# EAGLE design PCB Design (EAGLE 8.6.3)

## Sheet 1 of 2
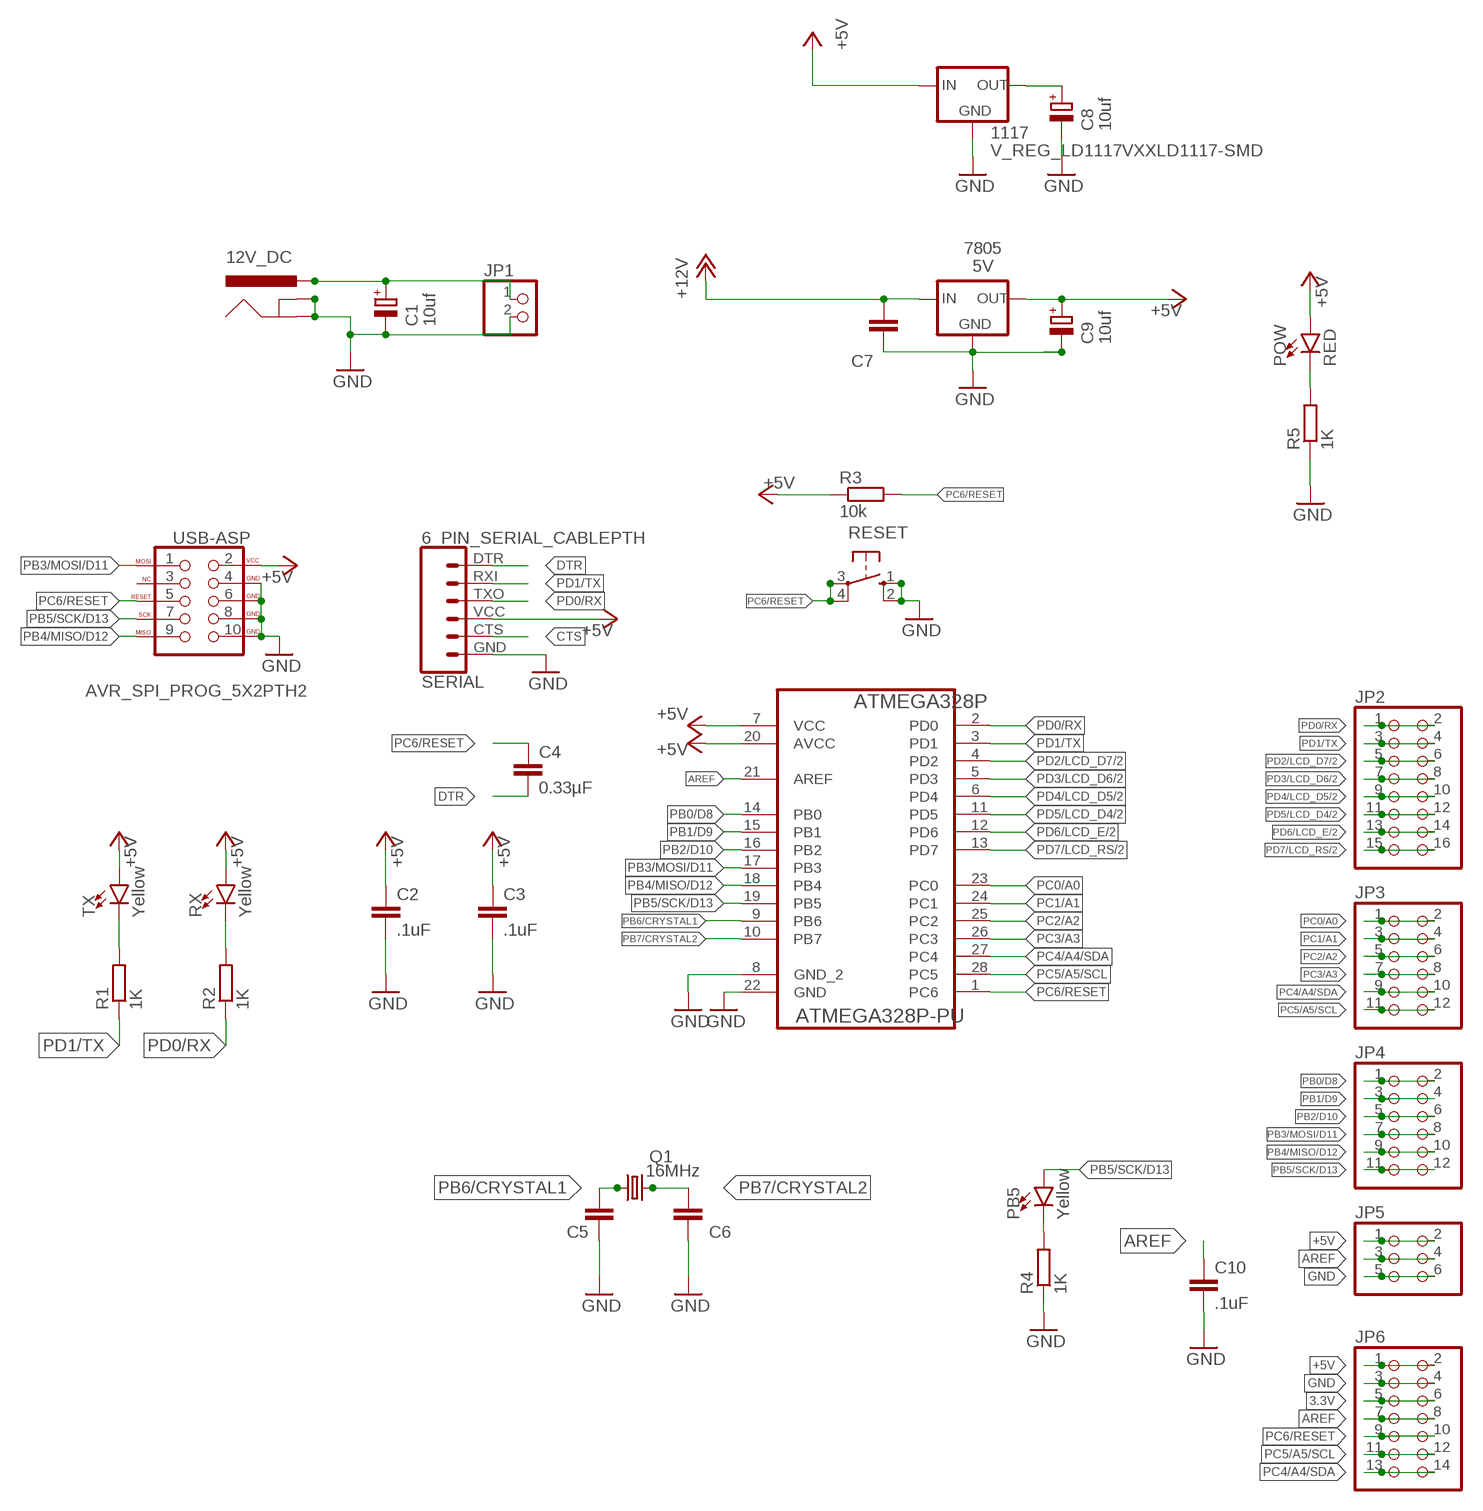
[diagram p0: schematic, sheet 1]

### Parts
12V_DC  POWER_JACK  [POWER_JACK_PTH]
1117  V_REG_LD1117VXXLD1117-SMD  [SOT223]
7805  5V  V_REG_78XX7812  [TO-252]
ATMEGA328P  ATMEGA328P-PU  [DIP254P762X457-28]
C1  10uf  CPOL-EUE2.5-6  [E2,5-6]
C2  .1uF  C-EUC0805K  [C0805K]
C3  .1uF  C-EUC0805K  [C0805K]
C4  0.33µF  C-EUC0805K  [C0805K]
C5  22pF  C-EUC0805K  [C0805K]
C6  22pF  C-EUC0805K  [C0805K]
C7  .1uf  C-EUC0805K  [C0805K]
C8  10uf  CPOL-EUE2.5-6  [E2,5-6]
C9  10uf  CPOL-EUE2.5-6  [E2,5-6]
C10  .1uF  C-EUC0805K  [C0805K]
JP1  PINHD-1X2  [1X02]
JP2  PINHD-2X8  [2X08]
JP3  PINHD-2X6  [2X06]
JP4  PINHD-2X6  [2X06]
JP5  PINHD-2X3  [2X03]
JP6  PINHD-2X7  [2X07]
PB5  Yellow  LED-BLUE0603  [LED-0603]
POW  RED  LED-BLUE0603  [LED-0603]
Q1  16MHz  CRYSTALHC49U70  [HC49U70]
R1  1K  R-EU_M0805  [M0805]
R2  1K  R-EU_M0805  [M0805]
R3  10k  R-EU_M0805  [M0805]
R4  1K  R-EU_M0805  [M0805]
R5  1K  R-EU_M0805  [M0805]
RESET  10-XX  [B3F-10XX]
RX  Yellow  LED-BLUE0603  [LED-0603]
SERIAL  6_PIN_SERIAL_CABLEPTH  [FTDI_BASIC]
TX  Yellow  LED-BLUE0603  [LED-0603]
USB-ASP  AVR_SPI_PROG_5X2PTH2  [2X5-SHROUDED]

### Nets
3.3V: 1117.2(OUT) C8.+ JP6.5 JP6.6
+5V: 1117.3(IN) 7805.2(OUT) ATMEGA328P.7(VCC) ATMEGA328P.20(AVCC) C2.1 C3.1 C9.+ JP5.1 JP5.2 JP6.1 JP6.2 POW.A R3.1 RX.A SERIAL.VCC TX.A USB-ASP.2(VCC) ; also sheet 2
+12V: 12V_DC.PWR 7805.1(IN) C1.+ C7.1 JP1.1
AREF: ATMEGA328P.21(AREF) C10.1 JP5.3 JP5.4 JP6.7 JP6.8
CTS: SERIAL.CTS
DTR: C4.2 SERIAL.DTR
GND: 12V_DC.GND 12V_DC.GNDBREAK 1117.1(GND) 7805.3(GND) ATMEGA328P.8(GND_2) ATMEGA328P.22(GND) C1.- C2.2 C3.2 C5.1 C6.1 C7.2 C8.- C9.- C10.2 JP1.2 JP5.5 JP5.6 JP6.3 JP6.4 R4.1 R5.1 RESET.1(S) RESET.2(S1) SERIAL.GND USB-ASP.4(GND) USB-ASP.6(GND) USB-ASP.8(GND) USB-ASP.10(GND) ; also sheet 2
N$1: PB5.C R4.2
N$2: POW.C R5.2
N$8: R2.2 RX.C
N$9: R1.2 TX.C
PB0/D8: ATMEGA328P.14(PB0) JP4.1 JP4.2
PB1/D9: ATMEGA328P.15(PB1) JP4.3 JP4.4
PB2/D10: ATMEGA328P.16(PB2) JP4.5 JP4.6
PB3/MOSI/D11: ATMEGA328P.17(PB3) JP4.7 JP4.8 USB-ASP.1(MOSI)
PB4/MISO/D12: ATMEGA328P.18(PB4) JP4.9 JP4.10 USB-ASP.9(MISO)
PB5/SCK/D13: ATMEGA328P.19(PB5) JP4.11 JP4.12 PB5.A USB-ASP.7(SCK)
PB6/CRYSTAL1: ATMEGA328P.9(PB6) C5.2 Q1.1
PB7/CRYSTAL2: ATMEGA328P.10(PB7) C6.2 Q1.2
PC0/A0: ATMEGA328P.23(PC0) JP3.1 JP3.2
PC1/A1: ATMEGA328P.24(PC1) JP3.3 JP3.4
PC2/A2: ATMEGA328P.25(PC2) JP3.5 JP3.6
PC3/A3: ATMEGA328P.26(PC3) JP3.7 JP3.8
PC4/A4/SDA: ATMEGA328P.27(PC4) JP3.9 JP3.10 JP6.13 JP6.14
PC5/A5/SCL: ATMEGA328P.28(PC5) JP3.11 JP3.12 JP6.11 JP6.12
PC6/RESET: ATMEGA328P.1(PC6) C4.1 JP6.9 JP6.10 R3.2 RESET.3(P) RESET.4(P1) USB-ASP.5(RESET)
PD0/RX: ATMEGA328P.2(PD0) JP2.1 JP2.2 R2.1 SERIAL.TXO
PD1/TX: ATMEGA328P.3(PD1) JP2.3 JP2.4 R1.1 SERIAL.RXI
PD2/LCD_D7: ATMEGA328P.4(PD2) JP2.5 JP2.6 ; also sheet 2
PD3/LCD_D6: ATMEGA328P.5(PD3) JP2.7 JP2.8 ; also sheet 2
PD4/LCD_D5: ATMEGA328P.6(PD4) JP2.9 JP2.10 ; also sheet 2
PD5/LCD_D4: ATMEGA328P.11(PD5) JP2.11 JP2.12 ; also sheet 2
PD6/LCD_E: ATMEGA328P.12(PD6) JP2.13 JP2.14 ; also sheet 2
PD7/LCD_RS: ATMEGA328P.13(PD7) JP2.15 JP2.16 ; also sheet 2
Unconnected: USB-ASP.3(NC)

## Sheet 2 of 2
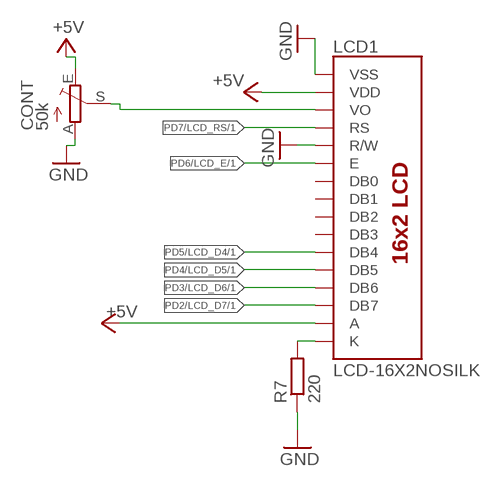
[diagram p1: schematic, sheet 2]

### Parts
CONT  50k  TRIM_EU-S64W  [S64W]
LCD1  LCD-16X2NOSILK  [LCD-16X2_NOSILK]
R7  220  R-EU_M0805  [M0805]

### Nets
+5V: CONT.E LCD1.2(VDD) LCD1.15(A) ; also sheet 1
GND: CONT.A LCD1.1(VSS) LCD1.5(R/W) R7.1 ; also sheet 1
N$6: CONT.S LCD1.3(VO)
N$14: LCD1.16(K) R7.2
PD2/LCD_D7: LCD1.14(DB7) ; also sheet 1
PD3/LCD_D6: LCD1.13(DB6) ; also sheet 1
PD4/LCD_D5: LCD1.12(DB5) ; also sheet 1
PD5/LCD_D4: LCD1.11(DB4) ; also sheet 1
PD6/LCD_E: LCD1.6(E) ; also sheet 1
PD7/LCD_RS: LCD1.4(RS) ; also sheet 1
Unconnected: LCD1.7(DB0) LCD1.8(DB1) LCD1.9(DB2) LCD1.10(DB3)

## Library data of the parts
12V_DC = SparkFun-Connectors:POWER_JACK: Power Jack Connector This is the standard 5.5mm barrel jack for power. The PTH is the most common, proven, reliable, footprint. The Slot footprint only works if the mill layer is transmitted to the PCB fab house so be warned. Here are the connectors we sell at SparkFun: DC Barrel Power Jack/Connector <https://www.sparkfun.com/products/119> (PRT-00119) DC Barrel Power Jack/Connector (SMD) <https://www.sparkfun.com/products/12748> (PRT-12748) DC Barrel Jack Adapter - Breadboard Compatible <https://www.sparkfun.com/products/10811> (PRT-10811) It is used on this SparkFun product (and many, many others): SparkFun RedBoard - Programmed with Arduino <https://www.sparkfun.com/products/12757> (DEV-12757) Also, if you need a mating power supply or connector, please check these out: Wall Adapter Power Supply - 9VDC 650mA <https://www.sparkfun.com/products/298> (TOL-00298) DC Barrel Jack Adapter - Male <https://www.sparkfun.com/products/10287> (PRT-10287); MF: MULTICOMP; MPN: SPC21365; OC_FARNELL: 1310918; PROD_ID: CONN-08197
1117 = SparkFun-IC-Power:V_REG_LD1117VXX: LD1117VXX voltage regulator. We carry the 3.3V version (COM-00526) in TO-220 package.; OC_FARNELL: unknown; PROD_ID: VREG-13917
7805 = SparkFun-IC-Power:V_REG_78XX: Voltage Regulator Standard 78xx regulator. IGO (Input Ground Output). Spark Fun Electronics SKU : COM-00107; OC_FARNELL: unknown; PROD_ID: VREG-12370; VALUE: +12v
ATMEGA328P = Atmel_By_element14_Batch_1-00:ATMEGA328P-PU: 8-bit Microcontroller with In-System Programmable Flash; MF: MICROCHIP; MPN: ATMEGA328P-PU; OC_FARNELL: 1715487; OC_NEWARK: 15R0268; PACKAGE: PDIP-28; SUPPLIER: Atmel
C1 C8 C9 = resistor:CPOL-EU: POLARIZED CAPACITOR, European symbol; OC_FARNELL: unknown
C2-C7 C10 = rcl:C-EU: CAPACITOR, European symbol; OC_FARNELL: unknown
CONT = pot:TRIM_EU-: POTENTIOMETER; OC_FARNELL: unknown
JP1 = pinhead:PINHD-1X2: PIN HEADER; OC_FARNELL: unknown
JP2 = pinhead:PINHD-2X8: PIN HEADER; OC_FARNELL: unknown
JP3 JP4 = pinhead:PINHD-2X6: PIN HEADER; OC_FARNELL: unknown
JP5 = pinhead:PINHD-2X3: PIN HEADER; OC_FARNELL: unknown
JP6 = pinhead:PINHD-2X7: PIN HEADER; OC_FARNELL: unknown
LCD1 = SparkFun-Displays:LCD-16X2: Standard text-only 16x2 parallel input LCD Basic 16 character by 2 line display. Typically utilizes the extremely common HD44780 parallel interface chipset SparkFun Products: Basic 16x2 Green <https://www.sparkfun.com/products/255> Basic 8x2 Green <https://www.sparkfun.com/products/11122>; OC_FARNELL: unknown; SF_ID: LCD-00255
PB5 POW RX TX = SparkFun-LED:LED-BLUE: Blue SMD LED Used in manufacturing of various products at SparkFun Packages: 0603 - SMD 0603 package [Product Link] <http://www.digikey.com/product-detail/en/SMLE12BC7TT86/511-1589-2-ND/1641808> 1206 - SMD1206 package [Product Link] <http://www.digikey.com/product-detail/en/lite-on-inc/LTST-C150TBKT/160-1643-1-ND/573584> SparkFun Products: ESP8266 Thing-Dev Board <https://www.sparkfun.com/products/13711> RedBoard <https://www.sparkfun.com/products/12757>; OC_FARNELL: unknown; PROD_ID: DIO-08575; VALUE: BLUE
Q1 = crystal:CRYSTAL: CRYSTAL; OC_FARNELL: unknown; OC_NEWARK: unknown
R1-R5 R7 = resistor:R-EU_: RESISTOR, European symbol; OC_FARNELL: unknown
RESET = switch-omron:10-XX: OMRON SWITCH; MF: OMRON ELECTRONIC COMPONENTS; MPN: B3F-1000; OC_FARNELL: 176432; OC_NEWARK: 36M3542
SERIAL = SparkFun-Connectors:6_PIN_SERIAL_CABLE: 6-pin header connection for use with the "FTDI BASIC" pinout - CABLE SIDE. Also known as "Arduino Serial Program Header". This is used on a design to provide a 6-pin connection point for serial communication usually from a USB cable (D+/D-) to these headers (RX/TX). It also has the remaining pins necessary for programming in the Arduino evironment (DTR, GND, and sometimes VCC). Note, this device has "CABLE" in the name. It is intended to be used on a design that usually lives on the end of your USB cable and prvides the converter chip (FTDI232 or FTDI231x) to commnicate serial RX/TX. The "sister" device, named "TARGET" is inteneded to be used on a design that contains a target micro-controller that you wish to program. You can populate with some of these: Female Headers <https://www.sparkfun.com/products/115> (PRT-00115) For reference (or to suit your programming needs) check out these designs: SparkFun FTDI Basic Breakout - 5V <https://www.sparkfun.com/products/9716> (DEV-09716) SparkFun FTDI Basic Breakout - 3.3V <https://www.sparkfun.com/products/9873> (DEV-09873) SparkFun FTDI SmartBasic <https://www.sparkfun.com/products/12935> (DEV-12935) SparkFun Beefy 3 - FTDI Basic Breakout <https://www.sparkfun.com/products/13746> (DEV-13746); OC_FARNELL: unknown
USB-ASP = SparkFun-Connectors:AVR_SPI_PROG_5X2: AVR 10-pin ICSP Header This is the standard AVR In Circuit Serial Programming header. Minimal, but includes pin one indicator. Works with standard Olimex programmers. SparkFun Products: 2x5 AVR ICSP Male Header <https://www.sparkfun.com/products/778> - PTH 2x5 Pin Shrouded Header <https://www.sparkfun.com/products/8506> - PTH2; OC_FARNELL: unknown; PROD_ID: CONN-08671; SF_ID: PRT-08506

## Board
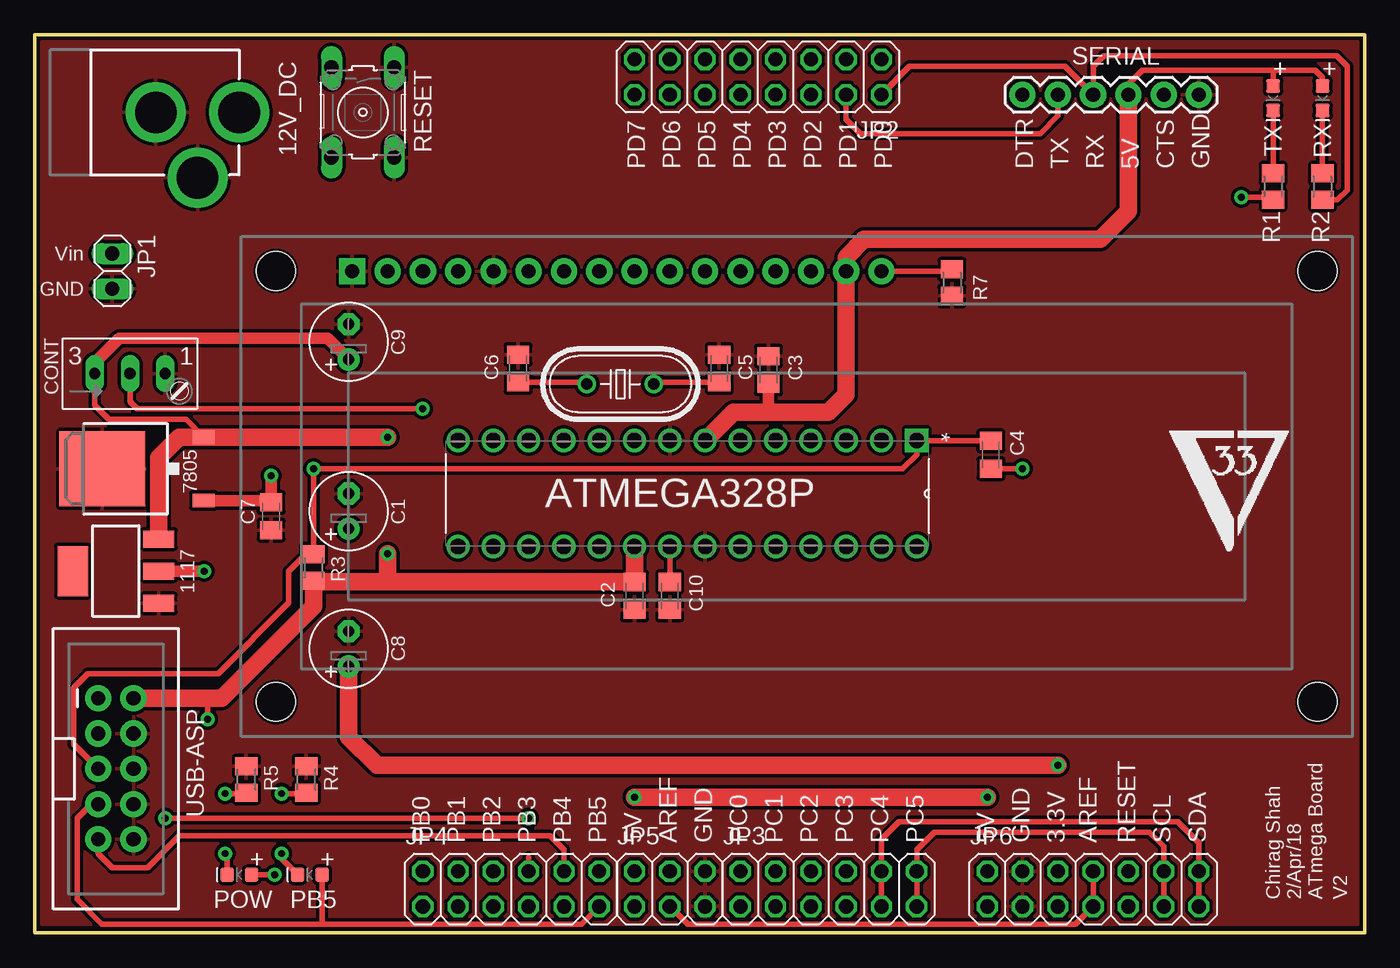
[diagram p2: board, top side]
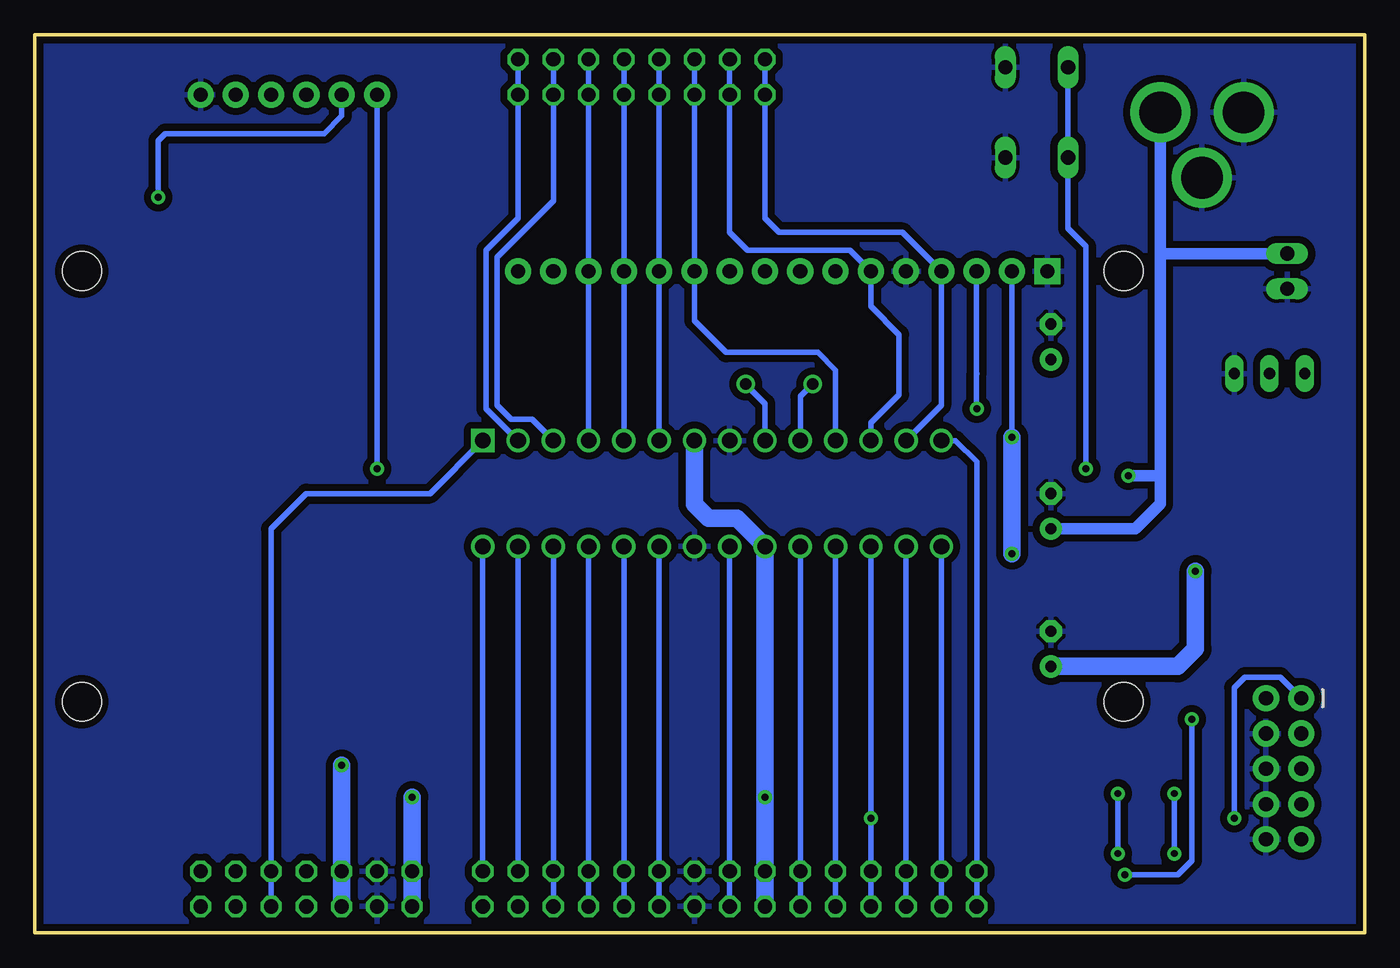
[diagram p3: board, bottom side, seen from below]

Size 95.76 x 64.64 mm. Coordinates in mm from the lower left corner, seen from the top.
Outline: 0,64.64 95.76,64.64 95.76,0 0,0 0,64.64
Copper layers (1*16): Top 0.035mm / dielectric 1.5mm / Bottom 0.035mm
Design rules "SparkFun-2-layer-STANDARD *": minimum track width 10mil, minimum drill 19mil, track to track 10mil, track to pad 8mil, pad to pad 8mil, via to via 10mil, smd to smd 8mil, copper to edge 8mil, drill to drill 8mil, minimum pad ring 10mil, minimum via ring 10mil, stop-mask expansion 4mil, vias tented up to drill 25mil, thermal gap 10mil

### Footprints (pad centres in the part's own frame; a part is rotated, then mirrored left to right if it is on the bottom)
POWER_JACK_PTH = drill 2.997 pad 4.318: GND 0,7.7; GNDBREAK 4.7,10.7; PWR 0,13.7
SOT223 = smd 1.219 x 2.235: 1 -2.311,-3.099; 2 0,-3.099; 3 2.311,-3.099 | smd 3.6 x 2.2: 4 0,3.099
TO-252 = smd 1 x 1.6: 1 -2.28,-4.8; 2 2.28,-4.8 | smd 5.4 x 6.2: 3 0,2.5
DIP254P762X457-28 = drill 1.118 square: 1 -7.62,33.02 | drill 1.118: 2 -7.62,30.48; 3 -7.62,27.94; 4 -7.62,25.4; 5 -7.62,22.86; 6 -7.62,20.32; 7 -7.62,17.78; 8 -7.62,15.24; 9 -7.62,12.7; 10 -7.62,10.16; 11 -7.62,7.62; 12 -7.62,5.08; 13 -7.62,2.54; 14 -7.62,0; 15 0,0; 16 0,2.54; 17 0,5.08; 18 0,7.62; 19 0,10.16; 20 0,12.7; 21 0,15.24; 22 0,17.78; 23 0,20.32; 24 0,22.86; 25 0,25.4; 26 0,27.94; 27 0,30.48; 28 0,33.02
E2,5-6 = drill 0.813 pad 1.6: + -1.27,0 | drill 0.813 pad 1.6 octagon: - 1.27,0
C0805K = smd 1.3 x 1.6: 1 -1,0; 2 1,0
S64W = drill 0.813 long: A 2.54,1.27; E -2.54,1.27; S 0,1.27
1X02 = drill 1.016 long: 1 -1.27,0; 2 1.27,0
2X08 = drill 1.016 octagon: 1 -8.89,-1.27; 2 -8.89,1.27; 3 -6.35,-1.27; 4 -6.35,1.27; 5 -3.81,-1.27; 6 -3.81,1.27; 7 -1.27,-1.27; 8 -1.27,1.27; 9 1.27,-1.27; 10 1.27,1.27; 11 3.81,-1.27; 12 3.81,1.27; 13 6.35,-1.27; 14 6.35,1.27; 15 8.89,-1.27; 16 8.89,1.27
2X06 = drill 1.016 octagon: 1 -6.35,-1.27; 2 -6.35,1.27; 3 -3.81,-1.27; 4 -3.81,1.27; 5 -1.27,-1.27; 6 -1.27,1.27; 7 1.27,-1.27; 8 1.27,1.27; 9 3.81,-1.27; 10 3.81,1.27; 11 6.35,-1.27; 12 6.35,1.27
2X03 = drill 1.016 octagon: 1 -2.54,-1.27; 2 -2.54,1.27; 3 0,-1.27; 4 0,1.27; 5 2.54,-1.27; 6 2.54,1.27
2X07 = drill 1.016 octagon: 1 -7.62,-1.27; 2 -7.62,1.27; 3 -5.08,-1.27; 4 -5.08,1.27; 5 -2.54,-1.27; 6 -2.54,1.27; 7 0,-1.27; 8 0,1.27; 9 2.54,-1.27; 10 2.54,1.27; 11 5.08,-1.27; 12 5.08,1.27; 13 7.62,-1.27; 14 7.62,1.27
LCD-16X2_NOSILK = drill 1.016 pad 1.88 square: 1 -32,15.5 | drill 1.016 pad 1.88: 2 -29.46,15.5; 3 -26.92,15.5; 4 -24.38,15.5; 5 -21.84,15.5; 6 -19.3,15.5; 7 -16.76,15.5; 8 -14.22,15.5; 9 -11.68,15.5; 10 -9.14,15.5; 11 -6.6,15.5; 12 -4.06,15.5; 13 -1.52,15.5; 14 1.02,15.5; 15 3.56,15.5; 16 6.1,15.5 | hole 2.8: -37.5,15.5; -37.5,-15.5; 37.5,15.5; 37.5,-15.5
LED-0603 = smd 1 x 1: A -0.877,0; C 0.877,0
HC49U70 = drill 0.813: 1 -2.413,0; 2 2.413,0
M0805 = smd 1.3 x 1.6: 1 -0.95,0; 2 0.95,0
B3F-10XX = drill 1.016 long: 1 -3.251,2.261; 2 3.251,2.261; 3 -3.251,-2.261; 4 3.251,-2.261
FTDI_BASIC = drill 1.016 pad 1.88: CTS 10.16,0; DTR 0,0; GND 12.7,0; RXI 2.54,0; TXO 5.08,0; VCC 7.62,0
2X5-SHROUDED = drill 1.016 pad 1.88: 1 -1.27,5.08; 2 1.27,5.08; 3 -1.27,2.54; 4 1.27,2.54; 5 -1.27,0; 6 1.27,0; 7 -1.27,-2.54; 8 1.27,-2.54; 9 -1.27,-5.08; 10 1.27,-5.08

### Placement (x,y rotation side)
12V_DC  1.02,59.05 270 top
1117  5.84,26.04 90 top
7805  7.37,33.4 90 top
ATMEGA328P  30.48,27.81 270 top
C1  22.61,30.35 90 top
C2  43.18,24.26 270 top
C3  52.83,40.51 90 top
C4  68.83,34.42 270 top
C5  49.28,40.62 270 top
C6  34.8,40.62 270 top
C7  17.02,29.99 270 top
C8  22.61,20.45 90 top
C9  22.61,42.55 90 top
C10  45.72,24.26 270 top
CONT  6.86,38.99 0 top
JP1  5.59,47.62 270 top
JP2  52.07,61.59 180 top
JP3  57.15,3.18 0 top
JP4  34.29,3.18 0 top
JP5  45.72,3.18 0 top
JP6  76.2,3.18 0 top
LCD1  54.86,32.13 0 top
PB5  19.81,4.19 180 top
POW  14.73,4.19 180 top
Q1  42.16,39.5 180 top
R1  89.15,53.72 90 top
R2  92.71,53.72 90 top
R3  20.07,26.29 90 top
R4  19.56,11.05 270 top
R5  15.24,11.05 270 top
R7  66.04,46.8 90 top
RESET  23.62,59.05 270 top
RX  92.71,60.07 270 top
SERIAL  71.12,60.33 0 top
TX  89.15,60.07 270 top
USB-ASP  5.84,11.81 0 top

### Tracks (layer width: path | path; a pad name or v marks a point on that pad's centre or on a via)
3.3V  (via drill 0.5)
  Top 0.813: v12.19,26.04 1117.2
  Top 1.27: C8.+ 22.61,14.1 24.64,12.07 v73.66,12.07
  Bottom 1.27: v12.19,26.04 12.19,20.45 13.46,19.18 C8.+ | JP6.5 JP6.6 v73.66,12.07
+5V  (via drill 0.5, 0.5 pad 0.55)
  Top 0.406: CONT.E 4.32,37.97 5.33,36.96 10.89,36.96 7805.2 12.19,35.71 | 12.45,16.89 v12.45,15.37 | v17.27,4.19 POW.A | SERIAL.VCC 78.74,61.09 79.76,62.1 89.15,62.1 | TX.A 89.15,62.1 | 89.15,62.1 92.2,62.1 92.71,61.59 RX.A
  Top 0.813: LCD1.15 | CONT.E 4.32,41.02 6.1,42.8 21.08,42.8 C9.+ | 20.15,25.26 R3.1 | v25.39,35.68 v25.4,35.69 | C3.1 52.83,37.47
  Top 1.27: ATMEGA328P.20 C2.1 25.4,25.26 | ATMEGA328P.7 50.29,37.47 52.83,37.47 57.15,37.47 58.42,38.73 LCD1.15 | SERIAL.VCC 78.74,51.94 76.71,49.91 59.69,49.91 58.42,48.64 LCD1.15 | 1117.3 8.94,34.21 10.41,35.68 7805.2 v25.39,35.68 | USB-ASP.2 12.45,16.89 13.46,16.89 20.07,23.5 R3.1 | v25.4,27.31 25.4,25.26 | 25.4,25.26 20.15,25.26 | v43.18,9.78 v68.58,9.78
  Bottom 0.406: v12.45,15.37 12.45,5.21 13.46,4.19 v17.27,4.19 | LCD1.2 v25.4,35.69
  Bottom 1.27: ATMEGA328P.7 48.26,30.86 47.24,29.85 45.21,29.85 ATMEGA328P.20 v43.18,9.78 JP5.2 JP5.1 | v68.58,9.78 JP6.2 JP6.1 | v25.4,35.69 v25.4,27.31
+12V  (via drill 0.5)
  Top 0.813: 7805.1 16.89,31.12 C7.1 v17.02,32.89
  Bottom 0.813: JP1.1 14.72,48.89 | 14.72,48.89 12V_DC.PWR | 14.72,48.89 14.72,32.89 | 14.72,32.89 14.72,30.88 16.51,29.08 C1.+ | v17.02,32.89 14.72,32.89
AREF
  Top 0.406: C10.1 ATMEGA328P.21 | JP5.3 47.02,0.61 74.91,0.61 JP6.7 JP6.8
  Bottom 0.406: JP5.3 JP5.4 ATMEGA328P.21
DTR  (via drill 0.5)
  Top 0.406: C4.2 68.85,33.4 v71.12,33.4
  Bottom 0.406: SERIAL.DTR v71.12,33.4
GND
  Top 0.406: 49.28,41.78 C5.1
  pour Bottom (isolate 0.508): 0.51,64.13 95.25,64.13 95.25,0.63 0.51,0.63
  pour Top: 95.25,0.63 95.25,64.13 0.51,64.13 0.51,0.63
N$1  (via drill 0.5)
  Top 0.406: v17.78,5.71 17.78,5.35 PB5.C | v17.78,10.03 19.49,10.03 R4.2
  Bottom 0.406: v17.78,10.03 v17.78,5.71
N$2  (via drill 0.5)
  Top 0.406: POW.C 13.86,5.58 v13.72,5.71 | v13.72,10.03 15.17,10.03 R5.2
  Bottom 0.406: v13.72,10.03 v13.72,5.71
N$6  (via drill 0.5)
  Top 0.406: CONT.S 6.86,38.23 7.37,37.72 v27.94,37.72
  Bottom 0.406: LCD1.3 27.94,40.26 | 27.94,40.26 | v27.94,37.72 27.94,40.26
N$8
  Top 0.406: RX.C R2.2
N$9
  Top 0.406: TX.C R1.2
N$14
  Top 0.406: 66.04,47.62 66.03,47.63 66.04,47.64 R7.2 65.92,47.63 LCD1.16
PB0/D8
  Bottom 0.406: ATMEGA328P.14 29.46,35.43 27.94,33.91 JP4.2 JP4.1
PB1/D9
  Bottom 0.406: ATMEGA328P.15 JP4.4 JP4.3
PB2/D10
  Bottom 0.406: ATMEGA328P.16 JP4.6 JP4.5
PB3/MOSI/D11  (via drill 0.5)
  Top 0.406: JP4.8 35.56,5.46 | v9.4,8.26 v35.56,8.26
  Bottom 0.406: ATMEGA328P.17 v35.56,8.26 JP4.8 JP4.7 | USB-ASP.1 6.1,18.41 8.64,18.41 9.4,17.65 v9.4,8.26
PB4/MISO/D12
  Top 0.406: JP4.10 38.1,5.97 37.08,6.98 10.41,6.98 8.13,4.7 5.59,4.7 4.57,5.71 USB-ASP.9
  Bottom 0.406: ATMEGA328P.18 JP4.10 JP4.9
PB5/SCK/D13
  Top 0.406: USB-ASP.7 4.06,9.27 3.05,8.26 3.05,2.41 4.83,0.63 20.83,0.63 | 20.83,0.63 39.37,0.63 JP4.11 | PB5.A 20.69,0.77 20.83,0.63
  Bottom 0.406: ATMEGA328P.19 JP4.12 JP4.11
PB6/CRYSTAL1
  Top 0.406: Q1.1 44.7,39.62 C5.2
  Bottom 0.406: Q1.1 43.18,38.1 ATMEGA328P.9
PB7/CRYSTAL2
  Top 0.406: Q1.2 39.62,39.62 C6.2
  Bottom 0.406: Q1.2 40.64,38.61 ATMEGA328P.10
PC0/A0
  Bottom 0.406: ATMEGA328P.23 JP3.2 JP3.1
PC1/A1
  Bottom 0.406: JP3.3 JP3.4 ATMEGA328P.24
PC2/A2
  Bottom 0.406: ATMEGA328P.25 JP3.6 JP3.5
PC3/A3
  Bottom 0.406: JP3.7 JP3.8 ATMEGA328P.26
PC4/A4/SDA
  Top 0.406: JP3.9 JP3.10 60.96,6.73 62.23,8 82.3,8 83.82,6.48 JP6.14 JP6.13
  Bottom 0.406: ATMEGA328P.27 JP3.10
PC5/A5/SCL
  Top 0.406: JP3.11 JP3.12 63.5,5.97 64.77,7.24 80.26,7.24 81.28,6.22 JP6.12 JP6.11
  Bottom 0.406: JP3.12 ATMEGA328P.28
PC6/RESET  (via drill 0.5)
  Top 0.406: C4.1 63.52,35.42 ATMEGA328P.1 63.5,34.42 62.48,33.4 v20.07,33.4 R3.2 19.49,27.24 18.29,26.04 18.29,23.75 13.21,18.67 3.81,18.67 2.79,17.65 2.79,13.59 USB-ASP.5
  Bottom 0.406: ATMEGA328P.1 67.31,31.62 76.2,31.62 78.74,29.08 JP6.10 JP6.9 | v20.07,33.4 20.07,49.4 21.36,50.7 RESET.4 RESET.3
PD0/RX
  Top 0.406: JP2.2 62.99,62.36 74.17,62.36 SERIAL.TXO 76.2,62.36 76.96,63.12 93.73,63.12 94.49,62.36 94.49,53.47 93.79,52.77 R2.1
  Bottom 0.406: ATMEGA328P.2 63.25,37.72 63.25,49.15 60.96,51.44 JP2.2 JP2.1
PD1/TX  (via drill 0.5)
  Top 0.406: SERIAL.RXI 73.66,58.8 72.39,57.53 59.44,57.53 58.42,58.55 JP2.4 | v86.87,52.96 88.97,52.96 R1.1
  Bottom 0.406: ATMEGA328P.3 59.94,36.96 61.47,36.96 62.48,37.97 62.48,48.64 58.42,52.7 JP2.4 JP2.3 | SERIAL.RXI 73.66,58.8 74.93,57.53 86.36,57.53 86.87,57.02 v86.87,52.96
PD2/LCD_D7
  Bottom 0.406: ATMEGA328P.4 LCD1.14 | LCD1.14 | LCD1.14 55.88,60.07 JP2.6 JP2.5
PD3/LCD_D6
  Bottom 0.406: ATMEGA328P.5 LCD1.13 53.34,50.16 53.34,50.17 JP2.8 JP2.7
PD4/LCD_D5
  Bottom 0.406: ATMEGA328P.6 LCD1.12 JP2.10 JP2.9
PD5/LCD_D4
  Bottom 0.406: ATMEGA328P.11 38.1,40.51 39.37,41.78 45.97,41.78 48.26,44.08 LCD1.11 JP2.12 JP2.11
PD6/LCD_E
  Bottom 0.406: ATMEGA328P.12 35.56,36.7 33.53,38.73 33.53,43.05 35.56,45.09 LCD1.6 37.08,49.15 44.45,49.15 45.72,50.42 JP2.14 JP2.13
PD7/LCD_RS
  Bottom 0.406: ATMEGA328P.13 30.48,37.97 LCD1.4 33.27,50.42 42.16,50.42 43.18,51.44 JP2.16 JP2.15

### Text on the board
tPlace: + | + | PD7 | PD6 | PD5 | PD4 | PD3 | PD2 | PD1 | PD0 | DTR | TX | RX | 5V | CTS | GND | Vin | GND | PB0 | PB1 | PB2 | PB3 | PB4 | PB5 | 5V | AREF | GND | PC0 | PC1 | PC2 | PC3 | PC4 | PC5 | 5V | GND | 3.3V | AREF | RESET | SCL | SDA | + | + | Chirag Shah / 2/Apr/18 | ATmega Board | V2